# EAGLE design dimmer (EAGLE 6.5.0)
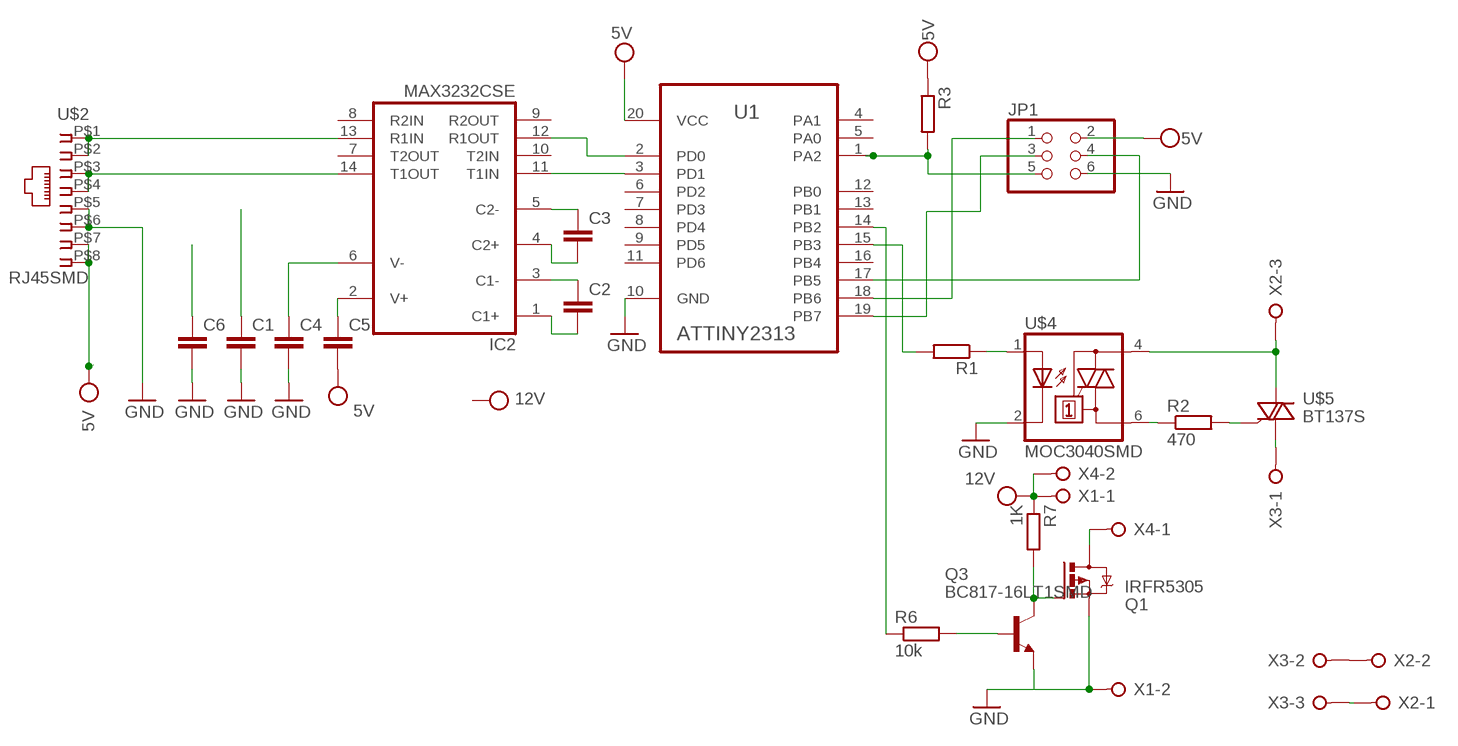
[diagram p0: schematic, sheet 1]

## Parts
C1  C-EUC1206  [C1206]
C2  C-EUC0603  [C0603]
C3  C-EUC0603  [C0603]
C4  C-EUC0603  [C0603]
C5  C-EUC0603  [C0603]
C6  C-EUC1206  [C1206]
IC2  MAX3232CSE  [SO16]
JP1  PINHD-2X3  [2X03]
Q1  IRFR5305  [D-PAK_TO252AA]
Q3  BC817-16LT1SMD  [SOT23-BEC]
R1  R-EU_R1206  [R1206]
R2  470  R-EU_R1206  [R1206]
R3  R-EU_R1206  [R1206]
R6  10k  R-EU_R1206  [R1206]
R7  1K  R-EU_R1206  [R1206]
U1  ATTINY2313  ATTINY2313-20SU  [SOIC127P1032X265-20N]
U$2  RJ45SMD  [RJ45SMD]
U$4  MOC3040SMD  [DIL6-SMD]
U$5  BT137S  [DPACK]
X1  W237-02P  [W237-132]
X2  W237-3E  [W237-3E]
X3  W237-3E  [W237-3E]
X4  W237-02P  [W237-132]

## Nets
GND: C1.2 C4.2 C6.2 JP1.6 Q1.3(S) Q3.E U1.10(GND) U$2.P$5 U$2.P$6 U$4.2(C) X1.2
N$1: R2.2 U$5.3(G)
N$2: Q3.B R6.2
N$3: IC2.13(R1IN) U$2.P$1 U$2.P$2
N$4: IC2.14(T1OUT) U$2.P$3 U$2.P$4
N$5: JP1.3 U1.19(PB7)
N$6: JP1.1 U1.18(PB6)
N$7: JP1.4 U1.17(PB5)
N$8: IC2.12(R1OUT) U1.2(PD0)
N$9: R1.1 U$4.1(A)
N$10: IC2.11(T1IN) U1.3(PD1)
N$12: Q1.1(G) Q3.C R7.2
N$13: R6.1 U1.14(PB2)
N$14: R1.2 U1.15(PB3)
N$15: Q1.4(D) X4.1
N$16: X2.1 X3.3
N$17: X2.2 X3.2
N$18: U$5.1(A1) X3.1
N$19: U$4.4(A2) U$5.2(A2) X2.3
N$20: R2.1 U$4.6(A1)
N$21: C3.1 IC2.5(C2-)
N$22: C3.2 IC2.4(C2+)
N$23: C2.1 IC2.3(C1-)
N$24: C2.2 IC2.1(C1+)
N$25: C4.1 IC2.6(V-)
N$26: C5.1 IC2.2(V+)
N$27: JP1.5 R3.2 U1.1(PA2)
VCC+5V: C1.1 C5.2 JP1.2 R3.1 U1.20(VCC) U$2.P$7 U$2.P$8 ; supply symbol labelled 5V
VCC+12V: C6.1 R7.1 X1.1 X4.2 ; supply symbol labelled 12V
Unconnected: IC2.7(T2OUT) IC2.8(R2IN) IC2.9(R2OUT) IC2.10(T2IN) U1.4(PA1) U1.5(PA0) U1.6(PD2) U1.7(PD3) U1.8(PD4) U1.9(PD5) U1.11(PD6) U1.12(PB0) U1.13(PB1) U1.16(PB4)

## Power pins joined to a net without a drawn wire
GND: IC2.15(GND)
VCC+5V: IC2.16(VCC)

## Library data of the parts
C1-C6 = rcl:C-EU: CAPACITOR, European symbol
IC2 = maxim:MAX3232*: True RS-232 Transceivers 3.0V to 5.5V, Low-Power up to 1Mbps, Using Four 0.1µF External Capacitors Source: http://pdfserv.maxim-ic.com/en/ds/MAX3222-MAX3241.pdf; MPN: MAX3232CSE; OC_FARNELL: 9725490; OC_NEWARK: 90C2890
JP1 = pinhead:PINHD-2X3: PIN HEADER
Q1 = transistor-power:IRF?5305: HEXFET Power MOSFET Source: http://www.irf.com/product-info/datasheets/data/irfr5305pbf.pdf
Q3 = transistor-npn:BC817*: NPN Transistor
R1-R3 R6 R7 = rcl:R-EU_: RESISTOR, European symbol
U1 = Atmel.By.element14:ATTINY2313-20SU: 8-bit Microcontroller with 2K Bytes In-System Programmable Flash; MPN: ATTINY2313-20SU; OC_FARNELL: 9171606; OC_NEWARK: 96K6526; PACKAGE: SOIC-20; SUPPLIER: Atmel
U$2 = con-tycoelectronics:RJ45SMD
U$4 = optocoupler:MOC3040SMD
U$5 = triac:BT137S
X1 X4 = con-wago-508:W237-02P: WAGO SREW CLAMP; OC_FARNELL: unknown; OC_NEWARK: unknown
X2 X3 = con-wago-508:W237-3E: WAGO SREW CLAMP; OC_FARNELL: unknown; OC_NEWARK: unknown

## Board
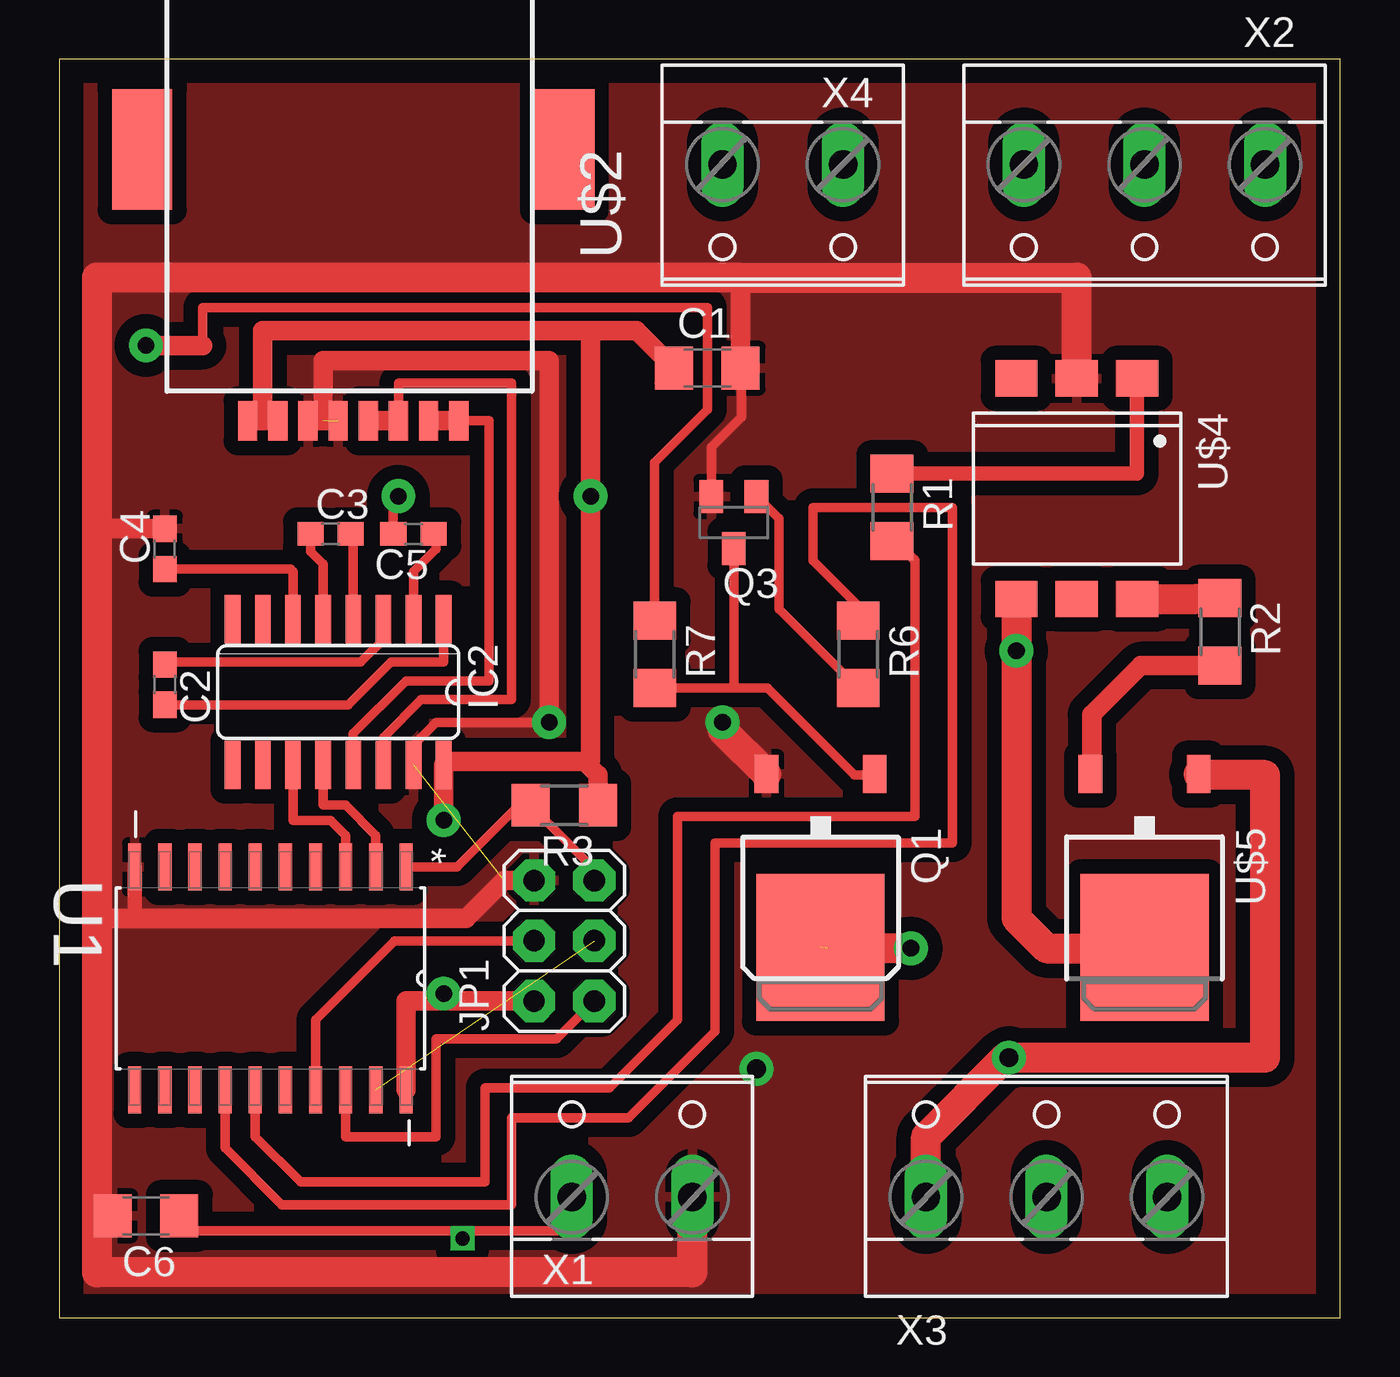
[diagram p1: board, top side]
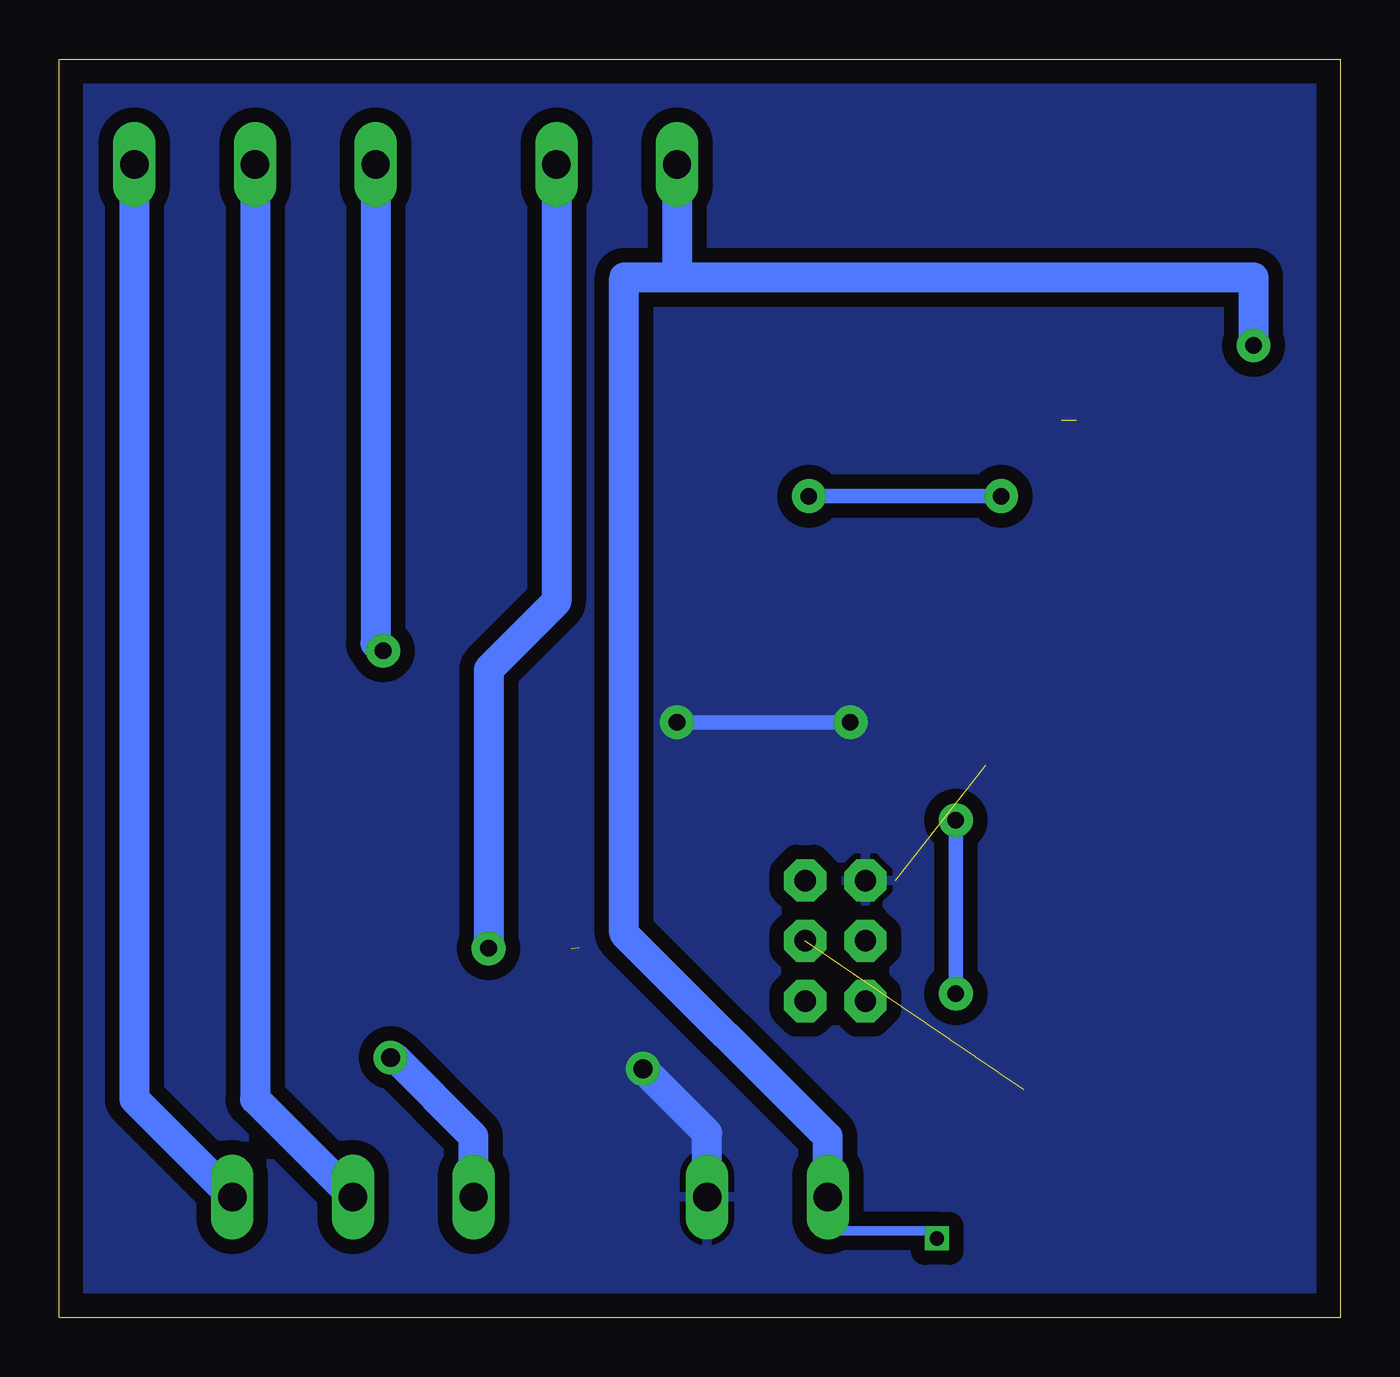
[diagram p2: board, bottom side, seen from below]

Size 53.96 x 53.01 mm. Coordinates in mm from the lower left corner, seen from the top.
Outline: 0,0 53.96,0 53.96,53.01 0,53.01 0,0
Copper layers (1*16): Top 0.035mm / dielectric 1.5mm / Bottom 0.035mm
Design rules "default": minimum track width 10mil, minimum drill 24mil, track to track 8mil, track to pad 8mil, pad to pad 8mil, via to via 8mil, smd to smd 8mil, copper to edge 40mil, drill to drill 8mil, minimum pad ring 10mil, minimum via ring 8mil, stop-mask expansion 4mil, vias tented up to drill 0mil, thermal gap 10mil

### Footprints (pad centres in the part's own frame; a part is rotated, then mirrored left to right if it is on the bottom)
C1206 = smd 1.6 x 1.8: 1 -1.4,0; 2 1.4,0
C0603 = smd 1.1 x 1: 1 -0.85,0; 2 0.85,0
SO16 = smd 0.66 x 2.032: 1 -4.445,-3.073; 2 -3.175,-3.073; 3 -1.905,-3.073; 4 -0.635,-3.073; 5 0.635,-3.073; 6 1.905,-3.073; 7 3.175,-3.073; 8 4.445,-3.073; 9 4.445,3.073; 10 3.175,3.073; 11 1.905,3.073; 12 0.635,3.073; 13 -0.635,3.073; 14 -1.905,3.073; 15 -3.175,3.073; 16 -4.445,3.073
2X03 = drill 0.9 pad 1.778 octagon: 1 -2.54,-1.27; 2 -2.54,1.27; 3 0,-1.27; 4 0,1.27; 5 2.54,-1.27; 6 2.54,1.27
D-PAK_TO252AA = smd 1 x 1.6: 1 -2.28,-4.8; 3 2.28,-4.8 | smd 5.4 x 6.2: 4 0,2.5
SOT23-BEC = smd 1 x 1.4: B -0.95,-1.1; C 0,1.1; E 0.95,-1.1
R1206 = smd 1.6 x 1.803: 1 -1.422,0; 2 1.422,0
SOIC127P1032X265-20N = smd 1.981 x 0.559: 1 -4.699,5.715; 2 -4.699,4.445; 3 -4.699,3.175; 4 -4.699,1.905; 5 -4.699,0.635; 6 -4.699,-0.635; 7 -4.699,-1.905; 8 -4.699,-3.175; 9 -4.699,-4.445; 10 -4.699,-5.715; 11 4.699,-5.715; 12 4.699,-4.445; 13 4.699,-3.175; 14 4.699,-1.905; 15 4.699,-0.635; 16 4.699,0.635; 17 4.699,1.905; 18 4.699,3.175; 19 4.699,4.445; 20 4.699,5.715
RJ45SMD = smd 0.813 x 1.676: P$1 -4.445,8.255; P$2 -3.175,8.255; P$3 -1.905,8.255; P$4 -0.635,8.255; P$5 0.635,8.255; P$6 1.905,8.255; P$7 3.175,8.255; P$8 4.445,8.255 | smd 2.54 x 5.08: P$9 8.89,-3.175; P$10 -8.89,-3.175
DIL6-SMD = smd 1.78 x 1.52: 1 -2.54,-4.645; 2 0,-4.645; 3 2.54,-4.645; 4 2.54,4.645; 5 0,4.645; 6 -2.54,4.645
DPACK = smd 1 x 1.6: 1 -2.28,-6.07; 3 2.28,-6.07 | smd 5.4 x 6.2: 2 0,1.23
W237-132 = drill 1.194 long: 1 -2.54,-0.635; 2 2.54,-0.635
W237-3E = drill 1.194 long: 1 -5.08,-0.635; 2 0,-0.635; 3 5.08,-0.635

### Placement (x,y rotation side)
C1  27.3,40.01 0 top
C2  4.45,26.67 270 top
C3  11.43,33.02 0 top
C4  4.45,32.38 90 top
C5  14.92,33.02 180 top
C6  3.65,4.29 180 top
IC2  11.75,26.35 180 top
JP1  21.27,15.88 90 top
Q1  32.07,18.1 180 top
Q3  28.42,33.5 180 top
R1  35.08,34.13 270 top
R2  48.9,28.89 270 top
R3  21.27,21.59 180 top
R6  33.66,27.94 270 top
R7  25.08,27.94 270 top
U1  8.89,14.29 270 top
U$2  12.38,46.04 180 top
U$4  42.86,34.92 180 top
U$5  45.72,16.83 180 top
X1  24.13,5.71 0 top
X2  45.72,47.94 180 top
X3  41.59,5.71 0 top
X4  30.48,47.94 180 top

### Tracks (layer width: path | path; a pad name or v marks a point on that pad's centre or on a via)
GND  (via drill 0.7 pad 1.42, 0.8 pad 1.42)  (2 unrouted)
  Top 0.406: IC2.15 14.92,24.13 15.87,25.08 v20.64,25.08 | 28.73,39.98 C1.2 28.73,39.98 28.73,37.94 27.47,36.67 Q3.E | C6.2 1.59,4.76
  Top 0.61: U1.10 3.18,16.83
  Top 0.813: v20.64,25.08 20.64,40.32 11.11,40.32 11.11,37.78 | C1.2 28.7,43.69 28.58,43.81 | C4.2 1.69,33.23 1.59,33.34 | JP1.6 18.73,18.41 17.14,16.83 3.18,16.83 1.9,16.83 1.59,17.14 | U$2.P$6 U$2.P$5
  Top 1.27: U$4.2 42.86,43.81 28.58,43.81 1.59,43.81 1.59,33.34 1.59,17.14 1.59,4.76 1.59,1.91 26.67,1.91 X1.2 | Q1.3 27.94,24.75 v27.94,25.08
  Bottom 0.61: v20.64,25.08 v27.94,25.08
  Bottom 1.27: X1.2 26.67,7.78 v29.37,10.48
  pour Top (isolate 0.61): -0.48,53.66 54.61,53.66 54.61,-0.48 -0.48,-0.48
  pour Bottom (isolate 0.61): -0.48,53.5 54.61,53.5 54.61,-0.64 -0.48,-0.64
N$1
  Top 0.813: R2.2 45.57,27.47 43.5,25.4 43.5,22.95 U$5.3
N$2
  Top 0.406: Q3.B 30.32,33.66 30.32,29.85 R6.2
N$3
  Top 0.406: IC2.13 12.38,24.61 14.61,26.83 18.1,26.83 18.1,37.78 U$2.P$1
  Top 0.813: U$2.P$2 U$2.P$1
N$4
  Top 0.406: IC2.14 13.65,24.45 15.24,26.04 19.05,26.04 19.05,39.37 14.29,39.37 U$2.P$3
  Top 0.813: U$2.P$4 U$2.P$3
N$5  (1 unrouted)
N$6
  Top 0.406: JP1.1 20.96,11.75 15.87,11.75 15.87,7.62 12.06,7.62 U1.18
N$7
  Top 0.406: JP1.4 14.13,15.88 10.79,12.54 U1.17
N$8
  Top 0.406: IC2.12 11.11,21.59 12.06,21.59 13.34,20.32 U1.2
N$9
  Top 0.61: U$4.1 45.4,35.56 35.4,35.56 R1.1
N$10
  Top 0.406: IC2.11 9.84,20.95 11.43,20.95 12.06,20.32 U1.3
N$11
  Bottom 1.27: 36.51,4.92 36.51,7.62 39.85,10.95
N$12
  Top 0.406: R7.2 28.42,26.52 | 28.42,26.52 29.84,26.52 33.5,22.86 34.31,22.86 Q1.1 | Q3.C 28.42,26.52
N$13
  Top 0.406: U1.14 6.98,7.14 9.37,4.76 19.05,4.76 19.05,8.41 23.97,8.41 27.62,12.06 27.62,20 37.62,20 37.62,34.13 31.75,34.13 31.75,31.9 33.66,30 R6.1
N$14
  Top 0.406: R1.2 36.04,31.91 36.04,27.3 36.04,21.11 26.03,21.11 26.03,12.54 23.18,9.68 17.94,9.68 17.94,5.71 10.16,5.71 8.26,7.62 U1.15
N$15  (via drill 0.7 pad 1.42)  (1 unrouted)
  Top 1.27: v35.88,15.56 32.38,15.56
  Bottom 1.27: X4.1 33.02,30.16 35.88,27.3 v35.88,15.56
N$16
  Bottom 1.27: X2.1 50.8,9.21 X3.3
N$17
  Bottom 1.27: X2.2 45.72,9.21 X3.2
N$18  (via drill 0.8 pad 1.42)
  Top 1.27: X3.1 36.51,7.62 39.85,10.95 v40.01,10.95 50.8,10.95 50.8,22.86 48.04,22.86 U$5.1
N$19  (via drill 0.7 pad 1.42)
  Top 1.27: U$4.4 v40.32,28.1 40.32,16.83 41.59,15.56 45.68,15.56 U$5.2
  Bottom 1.27: X2.3 40.64,28.42 v40.32,28.1
N$20
  Top 0.813: 47.91,30.28 R2.1
  Top 1.27: U$4.6 47.91,30.28
N$21
  Top 0.406: C3.1 10.58,32.28 11.11,31.75 IC2.5
N$22
  Top 0.406: IC2.4 12.38,33.23 C3.2
N$23
  Top 0.406: 4.66,27.62 C2.1 4.55,27.62 12.7,27.62 13.65,28.57 IC2.3
N$24
  Top 0.406: C2.2 12.17,25.82 13.97,27.62 16.19,27.62 IC2.1
N$25
  Top 0.406: C4.1 9.74,31.54 9.84,31.43 IC2.6
N$26
  Top 0.406: IC2.2 14.92,31.43 15.87,32.38 15.87,33.23 C5.1
N$27
  Top 0.406: JP1.5 22.54,18.89 R3.2 19.37,21.59 16.76,18.99 U1.1
VCC+5V  (via drill 0.7 pad 1.42)
  Top 0.406: IC2.16 16.29,23.44 | 25.27,39.37 C1.1 | C5.2 14.07,34.39 v14.29,34.61
  Top 0.813: JP1.2 16.19,13.34 | U1.20 14.61,13.34 16.19,13.34 | 16.19,13.34 v16.19,13.65 | IC2.16 v16.19,20.95 | 22.38,41.59 8.57,41.59 8.57,37.78 | 22.38,41.59 24.32,41.59 C1.1 | 16.29,23.44 22.01,23.44 | 22.01,23.44 22.38,23.5 v22.38,34.61 22.38,41.59 | 22.01,23.44 22.12,23.44 22.7,22.86 R3.1 | 8.57,37.78 U$2.P$8 | 8.57,37.78 U$2.P$7
  Bottom 0.61: v16.19,20.95 v16.19,13.65 | v14.29,34.61 v22.38,34.61
VCC+12V  (via drill 0.6 pad 0.81, 0.7 pad 1.42)
  Top 0.406: X1.1 21.59,3.65 5.69,3.65 C6.1 | 6.03,40.96 6.03,42.55 27.3,42.55 27.3,38.25 25.08,36.02 R7.1
  Top 0.813: v3.65,40.96 6.03,40.96
  Bottom 0.406: X1.1 21.59,3.65 16.99,3.65 v16.99,3.33
  Bottom 1.27: 27.94,43.81 3.65,43.81 v3.65,40.96 | X1.1 21.59,7.62 30.16,16.19 30.16,43.81 27.94,43.81 | X4.2 27.94,43.81